# Altium project obc-comm.PrjPcb
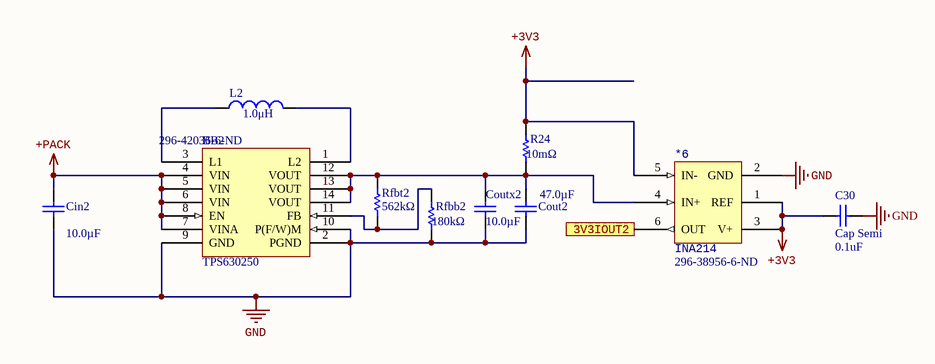
[diagram p0: eps_bb2.SchDoc]
3 sheets, 30 parts. Net scope: hierarchical (ports join the sheet entries above them; power ports are global).
Board file: obc_comm.PcbDoc
Sheets:
  eps_bb2.SchDoc
  bus-main.SchDoc
  eps_batt.SchDoc

## Sheet eps_bb2.SchDoc
size A4

### Parts
*6  INA214  Supplier Part Number 1: 296-38956-6-ND  [SOT65P210X110-6N]
BB2  TPS630250  Supplier Part Number 1: 296-42036-6-ND  [RNC0014A]
C30  Cap Semi  value 0.1uF  [1608[0603]]
Cin2  value 10.0µF  [1608[0603]]  (hidden comment: Cap)
Cout2  value 47.0µF  [1608[0603]]  (hidden comment: Cap)
Coutx2  value 10.0µF  [1608[0603]]  (hidden comment: Cap)
L2  value 1.0μH  [1608[0603]]  (hidden comment: Inductor)
R24  value 10mΩ  [1608[0603]]  (hidden comment: Res1)
Rfbb2  value 180kΩ  [1608[0603]]  (hidden comment: Res1)
Rfbt2  value 562kΩ  [1608[0603]]  (hidden comment: Rfbt1)

### Ports
3V3IOUT2 (out)

### Nets
+3V3: *6.1(REF) *6.3(V+) *6.5(IN-) C30.2 R24.2
+PACK: BB2.4(VIN) BB2.5(VIN) BB2.6(VIN) BB2.7(VINA) BB2.8(EN) Cin2.2
GND: *6.2(GND) BB2.2(PGND) BB2.9(GND) BB2.10(P(F/W)M) C30.1 Cin2.1 Cout2.1 Coutx2.1 Rfbb2.1
Net*6_4: *6.4(IN+) BB2.12(VOUT) BB2.13(VOUT) BB2.14(VOUT) Cout2.2 Coutx2.2 R24.1 Rfbt2.1
Net*6_6: *6.6(OUT) ; port 3V3IOUT2
NetBB2_1: BB2.1(L2) L2.2
NetBB2_3: BB2.3(L1) L2.1
NetBB2_11: BB2.11(FB) Rfbb2.2 Rfbt2.2

### Library data of the parts
*6 = INA214: Current monitor; Supplier 1: Digi-Key
BB2 = TPS630250: Buck-boost converter; Supplier 1: Digi-Key
C30 = Cap Semi: Capacitor (Semiconductor SIM Model); Published: 8-Jun-2000; LatestRevisionDate: 29-May-2009; LatestRevisionNote: IPC-7351 Footprint Added.; PackageReference: C1206; Publisher: Altium Limited; PackageDescription: Chip Capacitor
Cin2 Cout2 Coutx2 = Cap: Capacitor; Published: 8-Jun-2000; LatestRevisionDate: 17-Jul-2002; LatestRevisionNote: Re-released for DXP Platform.; PackageReference: RAD-0.3; Publisher: Altium Limited; PackageDescription: Radial Cap, Thru-Hole; 2 Leads; 0.3 in Pin Spacing
L2 = Inductor: Code_IEC: 1005; Published: 8-Jun-2000; LatestRevisionDate: 29-May-2009; LatestRevisionNote: IPC-7351 Footprint Added.; PackageReference: 0402-A; Publisher: Altium Limited; PackageDescription: Chip Inductor; Code_JEITA: 0402
R24 Rfbb2 Rfbt2 = Res1: Resistor; Published: 8-Jun-2000; LatestRevisionDate: 17-Jul-2002; LatestRevisionNote: Re-released for DXP Platform.; PackageReference: AXIAL-0.3; Publisher: Altium Limited; PackageDescription: Axial Device, Thru-Hole; 2 Leads; 0.3 in Pin Spacing

## Sheet bus-main.SchDoc
size A4
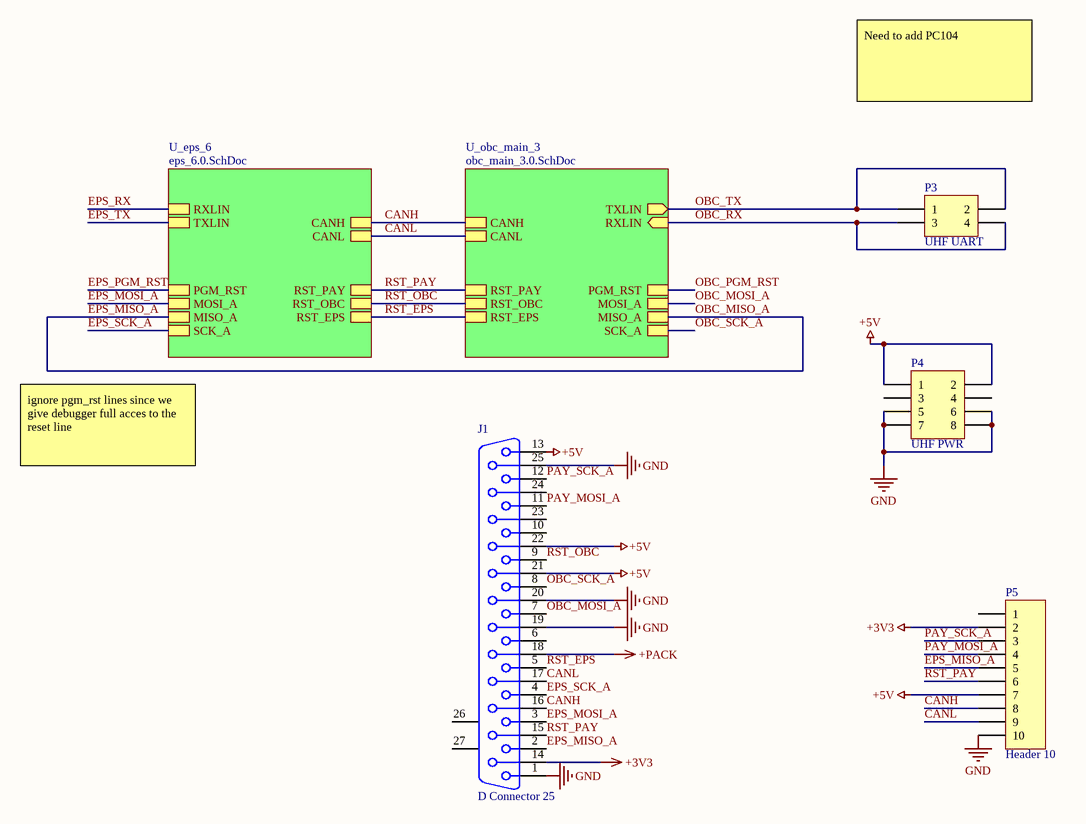
[diagram p1: bus-main.SchDoc]

### Parts
J1  D Connector 25  [Mini DSub Connector]
P3  UHF UART  [HDR2X2]
P4  UHF PWR  [HDR2X4]
P5  Header 10  [DF14-10P-1.25H(55) - duplicate]

### Sub-sheets
U_eps_6 = eps_6.0.SchDoc (file not in this document): RXLIN, TXLIN, RST_PAY, RST_OBC, RST_EPS, SCK_A, PGM_RST, MOSI_A, MISO_A, CANL, CANH
U_obc_main_3 = obc_main_3.0.SchDoc (file not in this document): RST_OBC, RST_EPS, CANL, RST_PAY, CANH, TXLIN (out), RXLIN (in), PGM_RST, MOSI_A, MISO_A, SCK_A

### Nets
+3V3: J1.14 P5.2
+5V: J1.13 J1.21 J1.22 P4.1 P4.2 P5.7
+PACK: J1.18
GND: J1.1 J1.19 J1.20 J1.25 P4.5 P4.6 P4.7 P4.8 P5.10
CANH: J1.16 P5.8 ; sheet U_obc_main_3/CANH, sheet U_eps_6/CANH
CANL: J1.17 P5.9 ; sheet U_obc_main_3/CANL, sheet U_eps_6/CANL
EPS_MISO_A: J1.2 P5.5 ; sheet U_obc_main_3/MISO_A, sheet U_eps_6/MISO_A  [also labelled OBC_MISO_A]
EPS_MOSI_A: J1.3 ; sheet U_eps_6/MOSI_A
EPS_PGM_RST: sheet U_eps_6/PGM_RST
EPS_RX: sheet U_eps_6/RXLIN
EPS_SCK_A: J1.4 ; sheet U_eps_6/SCK_A
EPS_TX: sheet U_eps_6/TXLIN
OBC_MOSI_A: J1.7 ; sheet U_obc_main_3/MOSI_A
OBC_PGM_RST: sheet U_obc_main_3/PGM_RST
OBC_RX: P3.3 P3.4 ; sheet U_obc_main_3/RXLIN
OBC_SCK_A: J1.8 ; sheet U_obc_main_3/SCK_A
OBC_TX: P3.1 P3.2 ; sheet U_obc_main_3/TXLIN
PAY_MOSI_A: J1.11 P5.4
PAY_SCK_A: J1.12 P5.3
RST_EPS: J1.5 ; sheet U_obc_main_3/RST_EPS, sheet U_eps_6/RST_EPS
RST_OBC: J1.9 ; sheet U_obc_main_3/RST_OBC, sheet U_eps_6/RST_OBC
RST_PAY: J1.15 P5.6 ; sheet U_obc_main_3/RST_PAY, sheet U_eps_6/RST_PAY

Not connected (* = marked no-connect by the designer): J1 6 10 23 24 26(MH1) 27(MH2); P4 3 4; P5 1

### Notes on the sheet
- Need to add PC104
- ignore pgm_rst lines since we give debugger full acces to the reset line

### Library data of the parts
J1 = D Connector 25: Receptacle Assembly, 25 Position, Right Angle; PackageDocument: U; Positions: 25; Published: 15-Jun-2001; LatestRevisionDate: 17-Jul-2002; LatestRevisionNote: Re-released for DXP Platform.; DatasheetDocument: 19-Mar-1999; PackageReference: 787202; Publisher: Altium Limited; Orientation: Right Angle; Gender: Receptacle; ComponentLink1Description: Mini-D25 - Molex, LLC 0836149012; ComponentLink1URL: https://www.digikey.ca/product-detail/en/molex-llc/0836149012/WM2144-ND/1867000
P3 = Header 2X2: Header, 2-Pin, Dual row; LatestRevisionDate: 17-Jul-2002; LatestRevisionNote: Re-released for DXP Platform.; Publisher: Altium Limited
P4 = Header 4X2: Header, 4-Pin, Dual row; LatestRevisionDate: 17-Jul-2002; LatestRevisionNote: Re-released for DXP Platform.; Publisher: Altium Limited
P5 = Header 10: Header, 10-Pin; LatestRevisionDate: 17-Jul-2002; LatestRevisionNote: Re-released for DXP Platform.; Publisher: Altium Limited

## Sheet eps_batt.SchDoc
size A4
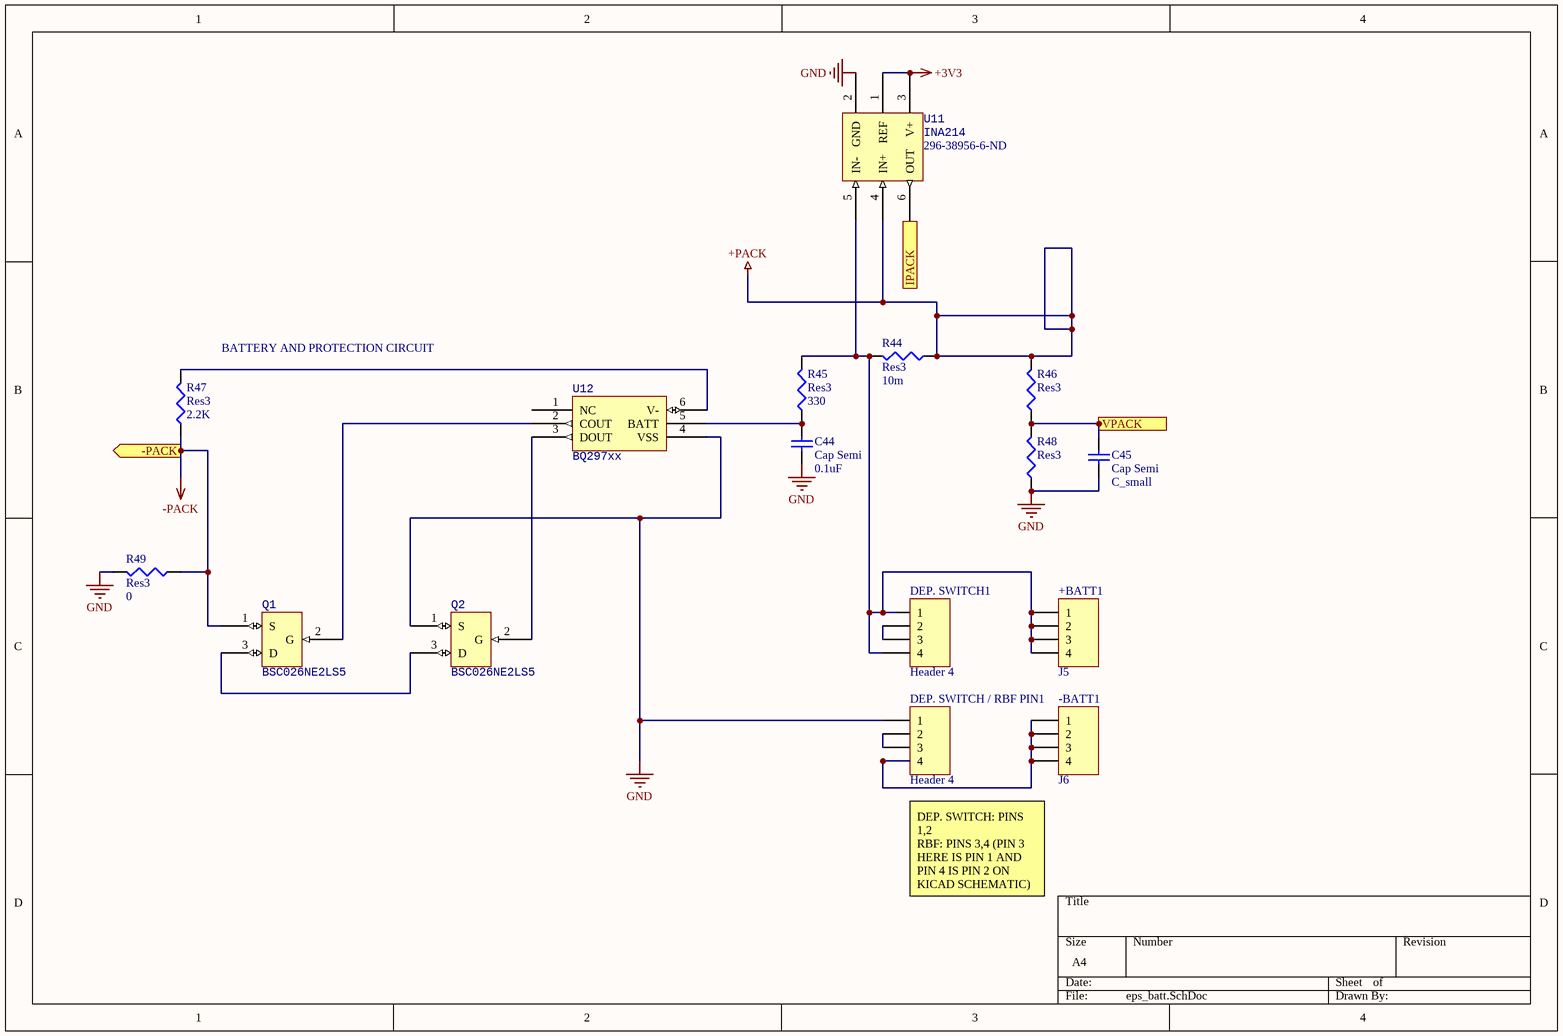
[diagram p2: eps_batt.SchDoc]

### Parts
+BATT1  J5  [DF14-4P-1.25H(55)]
-BATT1  J6  [DF14-4P-1.25H(55)]
C44  Cap Semi  value 0.1uF  [1608[0603]]
C45  Cap Semi  value C_small  [1608[0603]]
DEP._SWITCH1  Header 4  [DF14-4P-1.25H(55)]
DEP._SWITCH_/_RBF_PIN1  Header 4  [DF14-4P-1.25H(55)]
Q1  BSC026NE2LS5  [INF-PG-TDSON-8-1_V]
Q2  BSC026NE2LS5  [INF-PG-TDSON-8-1_V]
R44  Res3  value 10m  [J1-0603]
R45  Res3  value 330  [J1-0603]
R46  Res3  [J1-0603]
R47  Res3  value 2.2K  [J1-0603]
R48  Res3  [J1-0603]
R49  Res3  value 0  [J1-0603]
U11  INA214  Supplier Part Number 1: 296-38956-6-ND  [SOT65P210X110-6N]
U12  BQ297xx  [SON50P150X150X80-6N - duplicate1]

### Ports
-PACK (out), IPACK (out), VPACK (in)

### Nets
+3V3: U11.1(REF) U11.3(V+)
+PACK: R44.1 R46.2 U11.4(IN+)
-PACK: Q1.1(S) R47.1 R49.1 ; port -PACK
GND: C44.1 C45.1 DEP._SWITCH_/_RBF_PIN1.1 Q2.1(S) R48.1 R49.2 U11.2(GND) U12.4(VSS)
Net+BATT1_1: +BATT1.1 +BATT1.2 +BATT1.3 +BATT1.4 DEP._SWITCH1.1 DEP._SWITCH1.4 R44.2 R45.2 U11.5(IN-)
Net-BATT1_1: -BATT1.1 -BATT1.2 -BATT1.3 -BATT1.4 DEP._SWITCH_/_RBF_PIN1.4
NetC44_2: C44.2 R45.1 U12.5(BATT)
NetC45_2: C45.2 R46.1 R48.2 ; port VPACK
NetDEP._SWITCH1_2: DEP._SWITCH1.2 DEP._SWITCH1.3
NetDEP._SWITCH_/_RBF_PIN1_2: DEP._SWITCH_/_RBF_PIN1.2 DEP._SWITCH_/_RBF_PIN1.3
NetQ1_2: Q1.2(G) U12.2(COUT)
NetQ1_3: Q1.3(D) Q2.3(D)
NetQ2_2: Q2.2(G) U12.3(DOUT)
NetR47_2: R47.2 U12.6(V-)
NetU11_6: U11.6(OUT) ; port IPACK

Not connected (* = marked no-connect by the designer): U12 1(NC)

### Notes on the sheet
- (near R47) BATTERY AND PROTECTION CIRCUIT
- DEP. SWITCH: PINS 1,2
  RBF: PINS 3,4 (PIN 3 HERE IS PIN 1 AND PIN 4 IS PIN 2 ON KICAD SCHEMATIC)

### Library data of the parts
+BATT1 -BATT1 DEP._SWITCH1 DEP._SWITCH_/_RBF_PIN1 = Header 4: Header, 4-Pin; LatestRevisionDate: 17-Jul-2002; LatestRevisionNote: Re-released for DXP Platform.; Publisher: Altium Limited; ComponentLink1Description: Hirose DF14-4P-1.25H(55) Right Angle; ComponentLink1URL: https://www.digikey.ca/product-detail/en/hirose-electric-co-ltd/DF14-4P-1.25H-55/H10317-ND/964472
C44 C45 = Cap Semi: Capacitor (Semiconductor SIM Model); Published: 8-Jun-2000; LatestRevisionDate: 29-May-2009; LatestRevisionNote: IPC-7351 Footprint Added.; PackageReference: C1206; Publisher: Altium Limited; PackageDescription: Chip Capacitor
Q1 Q2 = BSC026NE2LS5: MOSFET; ComponentLink1Description: N-Channel Mosfet; ComponentLink1URL: https://www.digikey.ca/product-detail/en/infineon-technologies/BSC026NE2LS5ATMA1/BSC026NE2LS5ATMA1DKR-ND/6564538
R44-R49 = Res3: Resistor; Published: 8-Jun-2000; LatestRevisionDate: 29-May-2009; LatestRevisionNote: IPC-7351 Footprint Added.; PackageReference: J1-0603; Publisher: Altium Limited; PackageDescription: Chip Resistor
U11 = INA214: Current monitor; Supplier 1: Digi-Key; ComponentLink1Description: IC Current Monitor; ComponentLink1URL: https://www.digikey.ca/product-detail/en/texas-instruments/INA214AIDCKR/296-38956-1-ND/5143051
U12 = BQ2972: Battery protection; ComponentLink1Description: Charge Controller; ComponentLink1URL: https://www.digikey.com/product-detail/en/texas-instruments/BQ29729DSET/296-44131-1-ND/6005144

## Nets that join several sheets
+3V3: eps_bb2 (5 pins), bus-main (J1.14 P5.2), eps_batt (U11.1 U11.3)
+PACK: eps_bb2 (6 pins), bus-main (J1.18), eps_batt (R44.1 R46.2 U11.4)
GND: eps_bb2 (9 pins), bus-main (9 pins), eps_batt (8 pins)